# Altium schematic sheet Indicators.SchDoc
size A
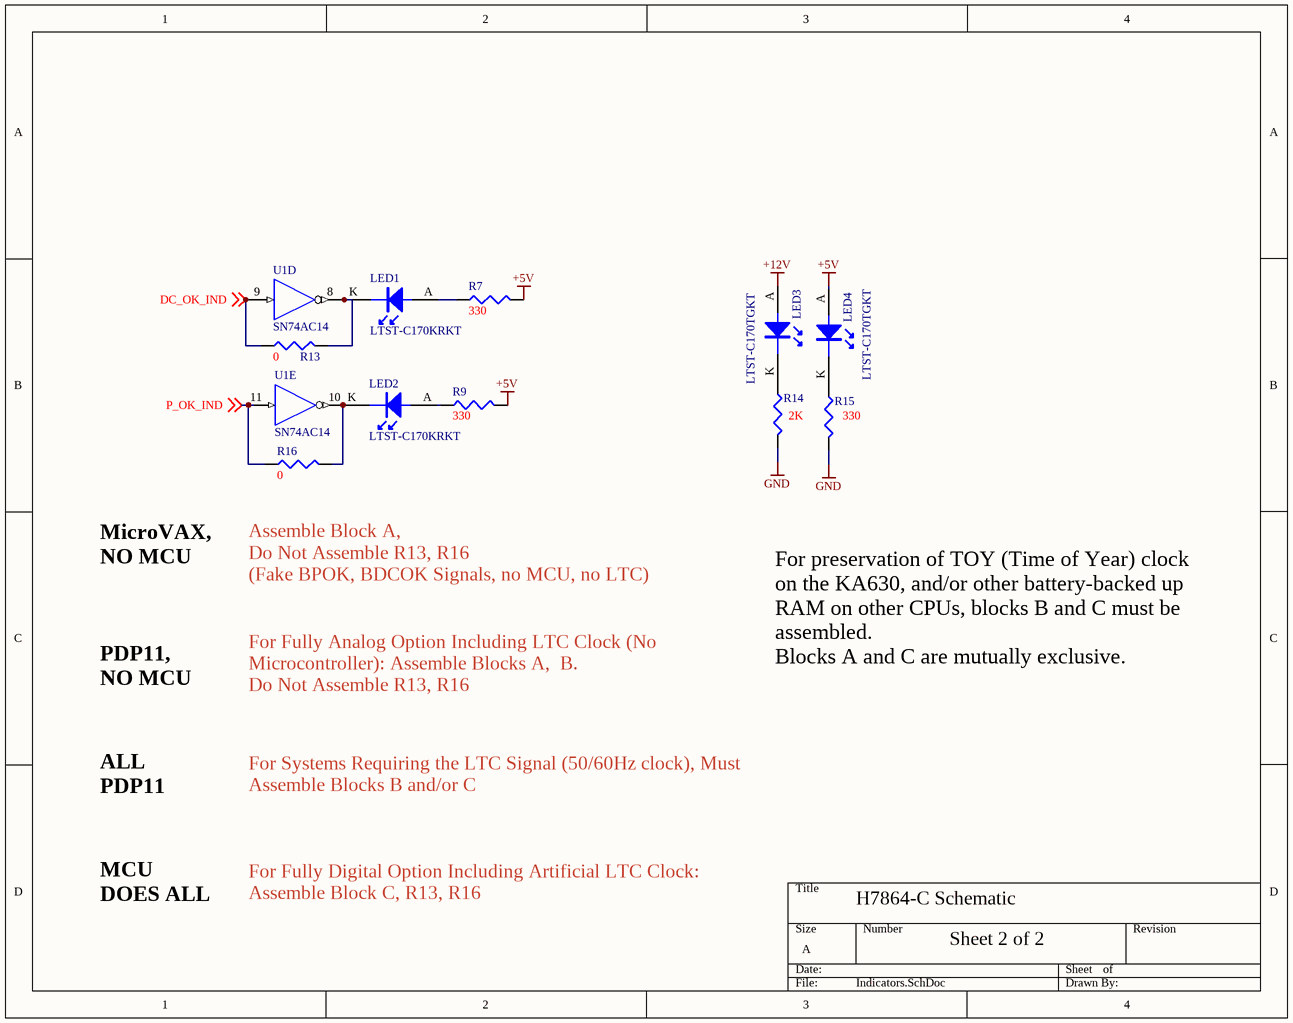
[diagram p0: Indicators.SchDoc]

## Parts
LED1  LTST-C170KRKT  [LTST-C170]
LED2  LTST-C170KRKT  [LTST-C170]
LED3  LTST-C170TGKT  [LTST-C170]
LED4  LTST-C170TGKT  [LTST-C170]
R7  330  [2012[0805]]
R9  330  [2012[0805]]
R13  value 0  [2012[0805]]  (hidden comment: CRCW080547K0FKEA)
R14  2K  [2012[0805]]
R15  330  [2012[0805]]
R16  value 0  [2012[0805]]  (hidden comment: CRCW080547K0FKEA)
U1  SN74AC14  [J014]  (parts D,E of 6)

## Nets
+5V: LED4.A R7.2 R9.2
+12V: LED3.A
GND: R14.2 R15.2 U1.7(GND)
VCC: U1.14(VCC)
DC_OK_IND: R13.1 U1.9(A) ; off-sheet DC_OK_IND
P_OK_IND: R16.1 U1.11(A) ; off-sheet P_OK_IND
NetLED1_A: LED1.A R7.1
NetLED1_K: LED1.K R13.2 U1.8(Y)
NetLED2_A: LED2.A R9.1
NetLED2_K: LED2.K R16.2 U1.10(Y)
NetLED3_K: LED3.K R14.1
NetLED4_K: LED4.K R15.1

## Notes on the sheet
- MicroVAX,
  NO MCU
- Assemble Block A,
  Do Not Assemble R13, R16
  (Fake BPOK, BDCOK Signals, no MCU, no LTC)
- PDP11,
  NO MCU
- For Fully Analog Option Including LTC Clock (No Microcontroller): Assemble Blocks A,  B.
  Do Not Assemble R13, R16
- For preservation of TOY (Time of Year) clock on the KA630, and/or other battery-backed up RAM on other CPUs, blocks B and C must be assembled.
  Blocks A and C are mutually exclusive.
- ALL
  PDP11
- For Systems Requiring the LTC Signal (50/60Hz clock), Must Assemble Blocks B and/or C
- MCU
  DOES ALL
- For Fully Digital Option Including Artificial LTC Clock:
  Assemble Block C, R13, R16
- H7864-C Schematic
- Sheet 2 of 2

## Library data of the parts
LED1 LED2 = LED: Value: EL-17-21SURC/S530-A2/TR8; P/N: LTST-C170KRKT
LED3 LED4 = LED: Value: EL-17-21SURC/S530-A2/TR8; P/N: LTST-C170KRKT
R7 R9 R15 = Res3: Resistor; P/N: CRCW0805330RFKEB; Value: 330; Published: 8-Jun-2000; LatestRevisionDate: 04-Mar-2005; LatestRevisionNote: PCB Footprint replaced.; PackageReference: J1-0603; Publisher: Altium Limited
R13 R16 = Res3: Resistor; P/N: CRCW08050000Z0EC; Published: 8-Jun-2000; LatestRevisionDate: 04-Mar-2005; LatestRevisionNote: PCB Footprint replaced.; PackageReference: J1-0603; Publisher: Altium Limited
R14 = Res3: Resistor; P/N: CRCW08052K00FKEAHP; Value: 2K; Published: 8-Jun-2000; LatestRevisionDate: 04-Mar-2005; LatestRevisionNote: PCB Footprint replaced.; PackageReference: J1-0603; Publisher: Altium Limited
U1 = SN74AHCT14D: Hex Schmitt-Trigger Inverter; Published: 8-Jun-2000; LatestRevisionDate: 13-Apr-2006; LatestRevisionNote: IPC-7351 Footprint Added.; DatasheetVersion: Apr-1999; PackageVersion: Jan-1998; PackageReference: D014; Publisher: Altium Limited; PackageDescription: 14-Pin Small Outline Integrated Circuit 1.27 mm Pitch; Code_IPC: SOIC127P600-14; ComponentLink1Description: Manufacturer Link; ComponentLink1URL: http://www.ti.com/; ComponentLink2Description: Datasheet; ComponentLink2URL: http://www-s.ti.com/sc/ds/sn74ahct14.pdf; ComponentLink3Description: Packaging Specification; ComponentLink3URL: http://focus.ti.com/lit/ml/mpds177/mpds177.pdf; P/N: SN74AHCT14D